# EAGLE design current_probe (EAGLE 6.1)
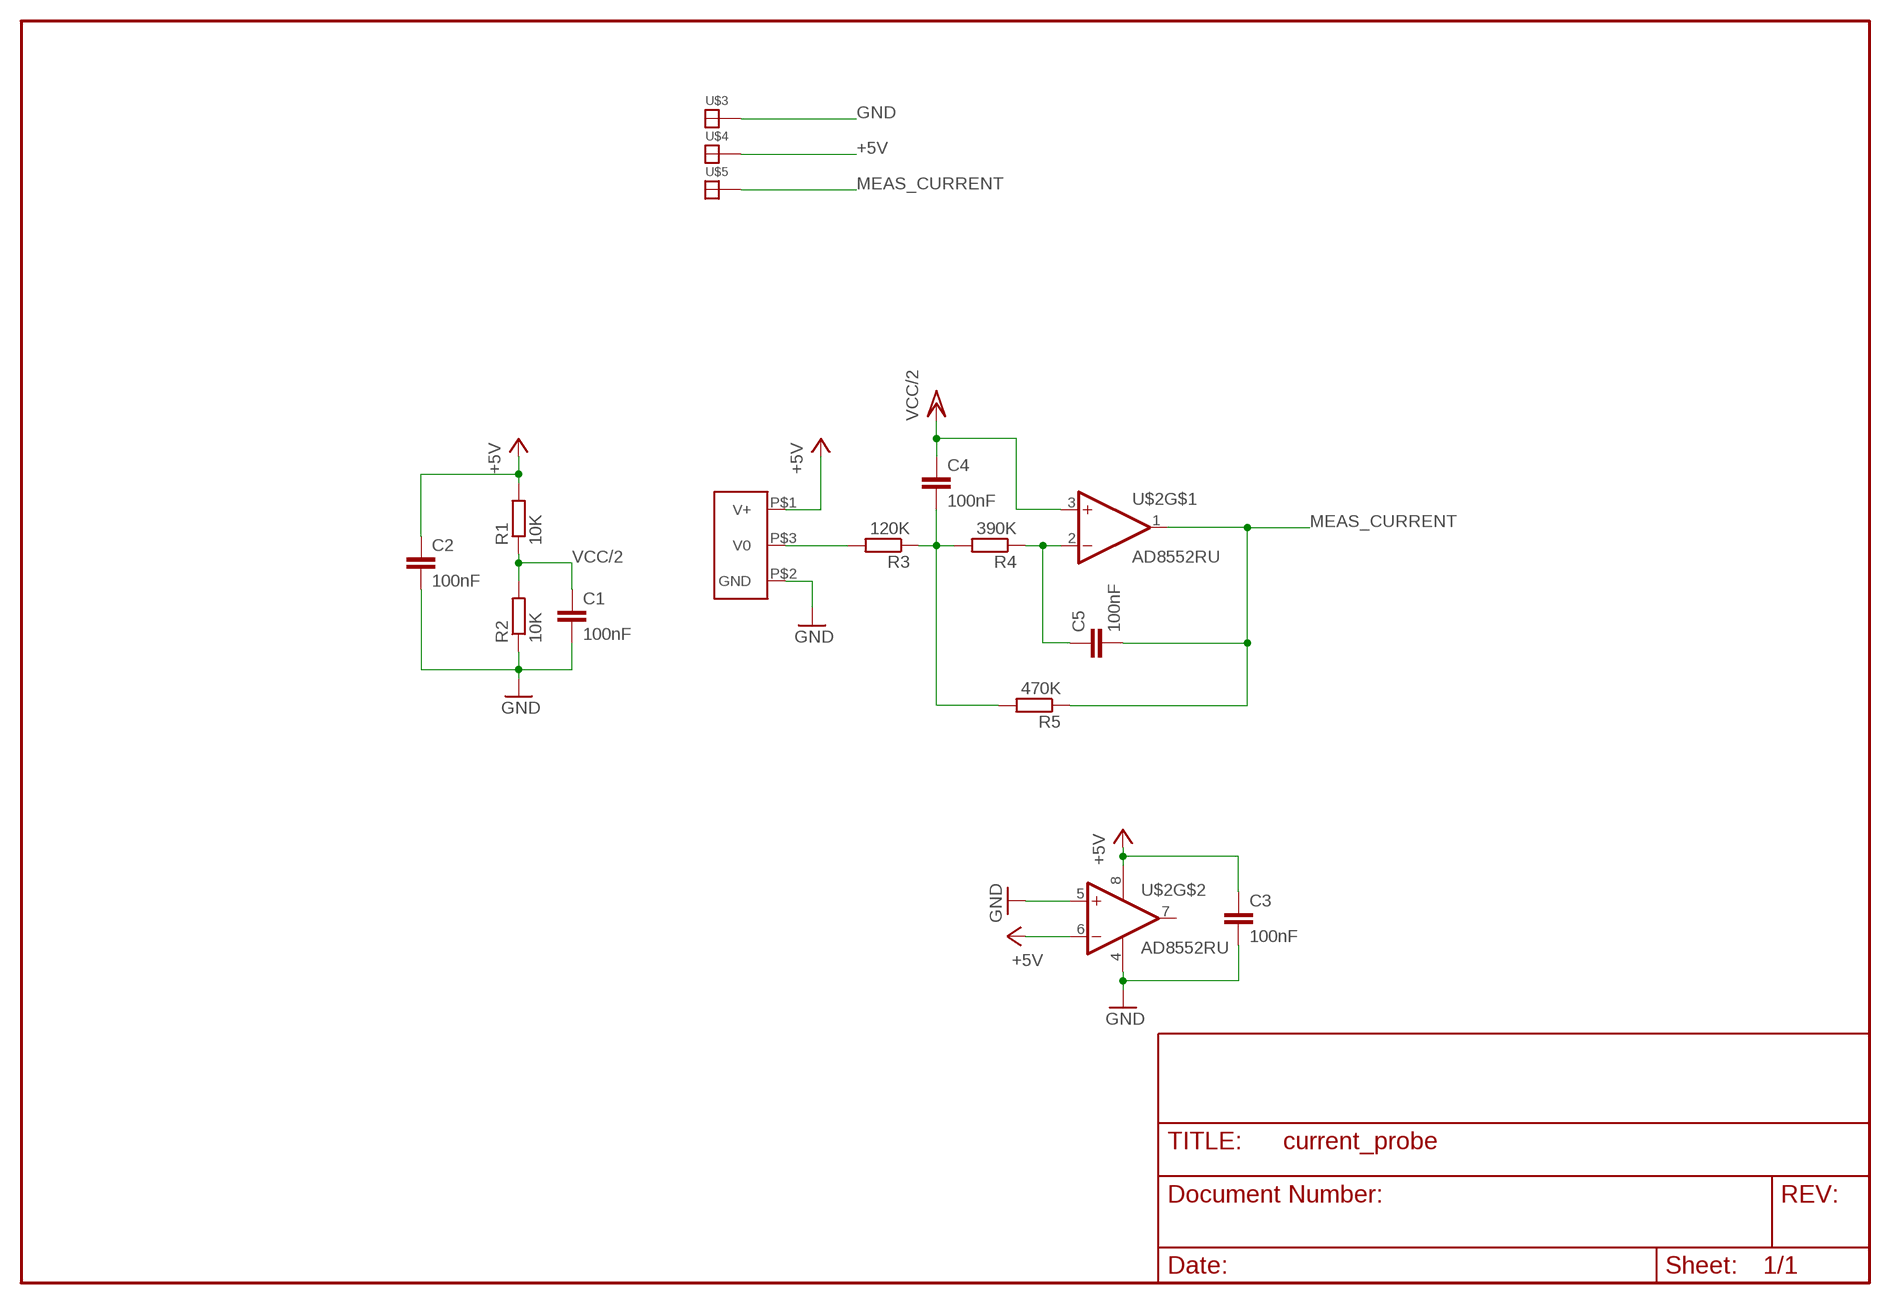
[diagram p0: schematic, sheet 1]

## Parts
C1  100nF  C-EUC0603K  [C0603K]
C2  100nF  C-EUC0603K  [C0603K]
C3  100nF  C-EUC0603K  [C0603K]
C4  100nF  C-EUC0603K  [C0603K]
C5  100nF  C-EUC0603K  [C0603K]
R1  10K  R-EU_R0603  [R0603]
R2  10K  R-EU_R0603  [R0603]
R3  120K  R-EU_R0603  [R0603]
R4  390K  R-EU_R0603  [R0603]
R5  470K  R-EU_R0603  [R0603]
U$1  SS495S  [SS495SND]
U$2  AD8552RU  [TSSOP8]
U$3  SOLDER_PAD100_50  [SOLDER_PAD_100_50]
U$4  SOLDER_PAD100_50  [SOLDER_PAD_100_50]
U$5  SOLDER_PAD100_50  [SOLDER_PAD_100_50]

## Nets
+5V: C2.1 C3.1 R1.2 U$1.P$1(V+) U$2.6(-IN) U$2.8(V+) U$4.P$1
GND: C1.2 C2.2 C3.2 R2.1 U$1.P$2(GND) U$2.4(V-) U$2.5(+IN) U$3.P$1
MEAS_CURRENT: C5.2 R5.1 U$2.1(OUT) U$5.P$1
N$4: R3.2 U$1.P$3(V0)
N$6: C4.2 R3.1 R4.2 R5.2
N$7: C5.1 R4.1 U$2.2(-IN)
VCC/2: C1.1 C4.1 R1.1 R2.2 U$2.3(+IN)
Unconnected: U$2.7(OUT)

## Library data of the parts
C1-C5 = rcl:C-EU: CAPACITOR, European symbol
R1-R5 = rcl:R-EU_: RESISTOR, European symbol
U$1 = paparazzi:SS495: Hall sensor
U$2 = paparazzi:AD8552: dual op amp
U$3-U$5 = paparazzi:SOLDER_PAD

## Board
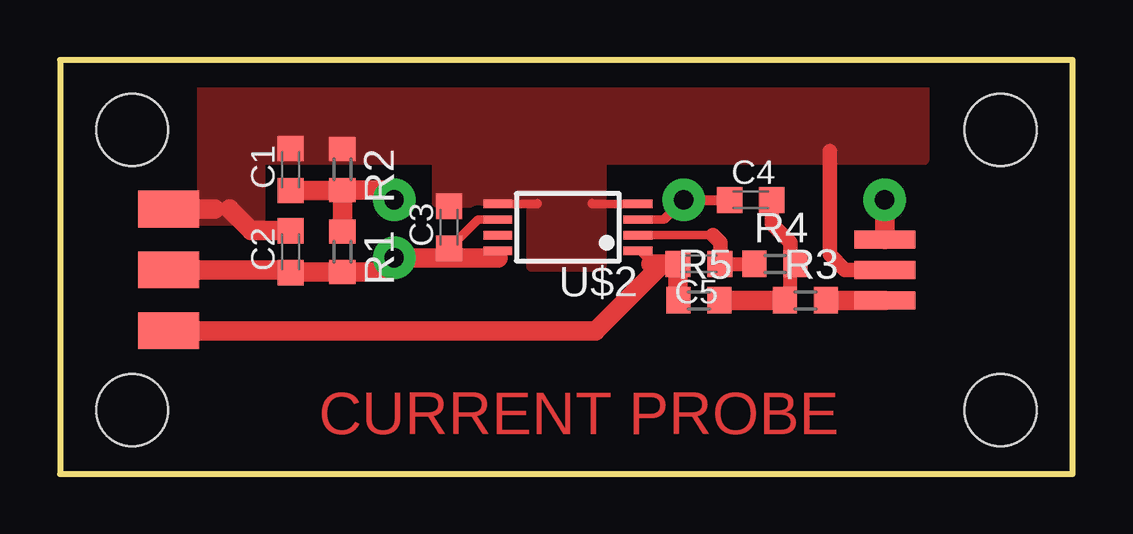
[diagram p1: board, top side]
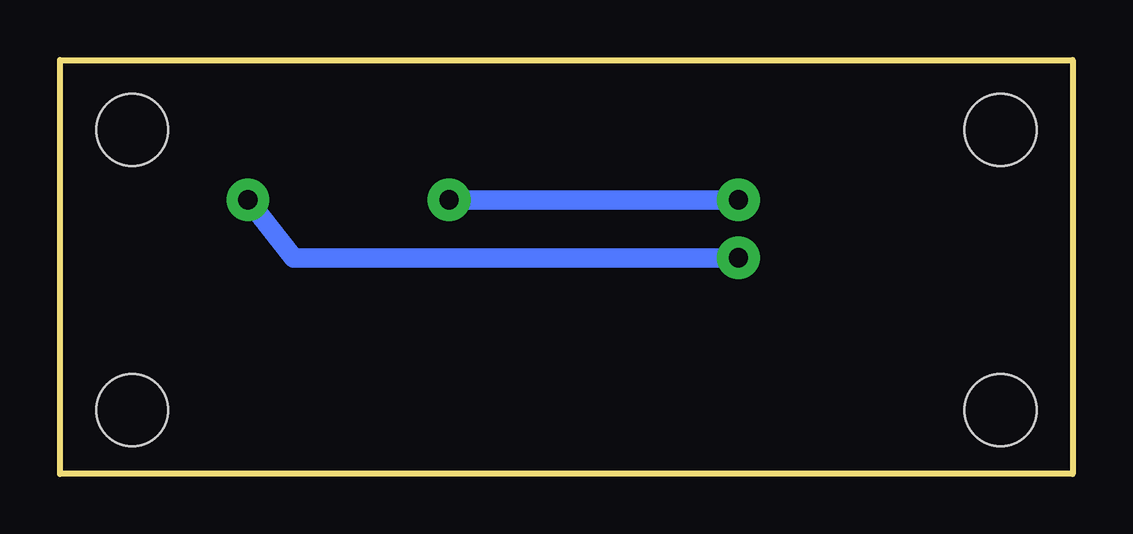
[diagram p2: board, bottom side, seen from below]

Size 42.21 x 17.26 mm. Coordinates in mm from the lower left corner, seen from the top.
Outline: 0,0 42.21,0 42.21,17.26 0,17.26 0,0
Copper layers (1*16): Top 0.035mm / dielectric 1.5mm / Bottom 0.035mm
Design rules: minimum track width 10mil, minimum drill 24mil, track to track 8mil, track to pad 8mil, pad to pad 8mil, via to via 8mil, smd to smd 8mil, copper to edge 40mil, drill to drill 8mil, minimum pad ring 10mil, minimum via ring 8mil, stop-mask expansion 4mil, vias tented up to drill 0mil, thermal gap 10mil
Holes 3 mm at 3.01,2.66 39.2,14.35 39.2,2.66 3.01,14.35

### Footprints (pad centres in the part's own frame; a part is rotated, then mirrored left to right if it is on the bottom)
C0603K = smd 1.05 x 1.08: 1 -0.875,0; 2 0.875,0
R0603 = smd 1 x 1.1: 1 -0.85,0; 2 0.85,0
SS495SND = smd 2.54 x 0.762: P$1 0,1.27; P$2 0,0; P$3 0,-1.27
TSSOP8 = smd 0.35 x 1.2: 1 -0.975,-2.925; 2 -0.325,-2.925; 3 0.325,-2.925; 4 0.975,-2.925; 5 0.975,2.925; 6 0.325,2.925; 7 -0.325,2.925; 8 -0.975,2.925
SOLDER_PAD_100_50 = smd 2.54 x 1.524: P$1 0,0

### Placement (x,y rotation side)
C1  9.61,12.7 90 top
C2  9.61,9.27 90 top
C3  16.22,10.28 90 top
C4  28.79,11.43 0 top
C5  26.63,8.76 180 top
R1  11.77,9.27 270 top
R2  11.77,12.7 270 top
R3  31.08,7.23 0 top
R4  29.81,8.76 0 top
R5  26.63,7.23 0 top
U$1  34.38,8.5 0 top
U$2  21.17,10.28 90 top
U$3  4.53,11.04 0 top
U$4  4.53,8.5 0 top
U$5  4.53,5.96 0 top

### Tracks (layer width: path | path; a pad name or v marks a point on that pad's centre or on a via)
+5V  (via drill 0.8 pad 1.78)
  Top 0.356: U$2.8 18.25,9.27 18.25,9.01 | 16.22,9.01 C3.1 | C3.1 | U$2.6 17.43,10.61 C3.1
  Top 0.406: R1.2 11.77,8.5
  Top 0.813: 9.61,8.38 9.49,8.5 | 9.61,8.38 C2.1 9.61,8.5 U$4.P$1 | 9.61,8.38 9.65,8.42 R1.2 13.34,8.42 v13.93,9.01 16.22,9.01 18.25,9.01 | v34.38,11.43 U$1.P$1
  Bottom 0.813: v13.93,9.01 32.47,9.01 v34.38,11.43
GND
  Top 0.356: U$2.5 19.9,11.26 19.9,11.3 | U$2.4 22.19,11.26 22.19,11.3
  Top 0.61: U$1.P$2 32.73,8.5 32.09,9.14 32.09,13.46
  Top 0.813: C2.2 7.98,10.14 7.07,11.04 | U$3.P$1 6.44,11.04
  pour Top (isolate 0.406, no thermals): 5.93,16.12 36.03,16.12 36.03,13.08 22.57,13.08 22.57,8.63 19.65,8.63 19.65,11.3 15.71,11.3 15.71,13.08 8.34,13.08 8.34,10.54 5.93,10.54
MEAS_CURRENT
  Top 0.356: U$2.1 24.18,9.31 24.73,8.76
  Top 0.406: 24.65,8.76 24.73,8.76
  Top 0.813: 25.11,8.76 24.65,8.76 | U$5.P$1 22.31,5.96 25.11,8.76 | C5.2 25.87,8.76 | 24.73,8.76 25.11,8.76 | 25.11,8.76 C5.2 | R5.1 25.74,7.23 25.76,7.25 C5.2
N$4
  Top 0.813: R3.2 U$1.P$3
N$6
  Top 0.584: R4.2 30.44,8.76 30.44,7.45 R3.1
  Top 0.61: 30.44,8.76 30.44,9.65 29.68,10.41 29.68,11.43 C4.2
  Top 0.813: R5.2 R3.1
N$7
  Top 0.356: U$2.2 27.21,9.96
  Top 0.406: 27.52,8.76 C5.1
  Top 0.584: C5.1 R4.1
  Top 0.61: 27.21,9.96 27.52,9.65 27.52,8.76
VCC/2  (via drill 0.8 pad 1.78)
  Top 0.356: U$2.3 25.18,10.61 25.23,10.66 | C4.1 28.03,11.43
  Top 0.406: 25.23,10.66 v26,11.43 C4.1
  Top 0.813: v13.93,11.43 13.51,11.85 R2.2 11.77,11.81 | C1.1 11.76,11.82 11.77,11.81 | 11.77,11.81 R1.1
  Bottom 0.813: v13.93,11.43 v26,11.43

### Text on the board
Top: CURRENT PROBE